# Altium schematic sheet InputISO_Block.SchDoc
size A4; SheetNumber: 4; SheetTotal: 9
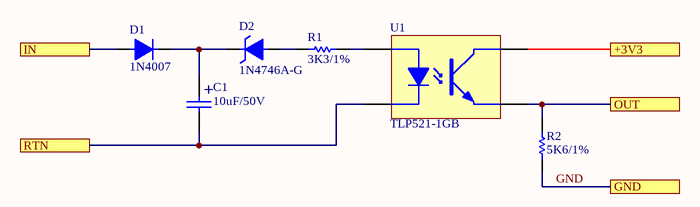
[diagram p0: InputISO_Block.SchDoc]

## Parts
C1  10uF/50V  [CAP100RP]
D1  1N4007  [DO41]
D2  1N4746A-G  [DO40]
R1  3K3/1%  [RES400]
R2  5K6/1%  [RES400]
U1  TLP521-1GB  [DIP4]

## Ports
+3V3, GND, IN, OUT, RTN

## Nets
+3V3: U1.4(C) ; port +3V3
GND: R2.1 ; port GND
IN: D1.1 ; port IN
OUT: R2.2 U1.3(E) ; port OUT
RTN: C1.2 U1.2(K) ; port RTN
NetC1_1: C1.1 D1.2 D2.2
NetD2_1: D2.1 R1.1
NetR1_2: R1.2 U1.1(A)

## Notes on the sheet
- (in symbol CAPPOL-THT) +

## Library data of the parts
C1 = CAPPOL-THT: JLCPart: C2960372
D1 = DIODE RECTIFIER: JLCPart: C3033995
D2 = DIODE ZENER: JLCPart: C391338
R1 R2 = RES-THT
  R1: JLCPart: C119335
  R2: JLCPart: C173035
U1 = TLP521-1: JLCPart: C69256